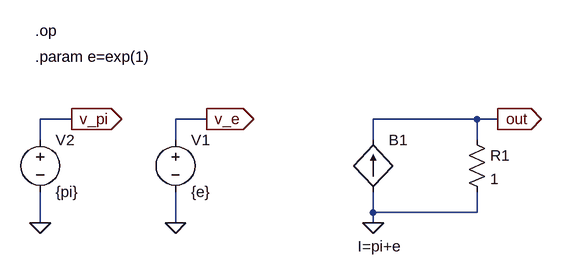
[diagram p0: schematic pi_e.asc]
pi_e.asc, the LTspice schematic file:
Version 4
SHEET 1 1572 680
WIRE -432 208 -432 176
WIRE -432 336 -432 288
WIRE -384 176 -432 176
WIRE -224 208 -224 176
WIRE -224 336 -224 288
WIRE -176 176 -224 176
WIRE 80 208 80 176
WIRE 80 320 80 288
WIRE 80 336 80 320
WIRE 240 176 80 176
WIRE 240 208 240 176
WIRE 240 320 80 320
WIRE 240 320 240 288
WIRE 272 176 240 176
FLAG -224 336 0
FLAG -176 176 v_e
IOPIN -176 176 Out
FLAG 80 336 0
FLAG 272 176 out
IOPIN 272 176 Out
FLAG -432 336 0
FLAG -384 176 v_pi
IOPIN -384 176 Out
SYMBOL bi2 80 208 R0
WINDOW 3 -24 164 Left 0
SYMATTR Value I=pi+e
SYMATTR InstName B1
SYMBOL res 224 192 R0
SYMATTR InstName R1
SYMATTR Value 1
SYMBOL voltage -224 192 R0
SYMATTR InstName V1
SYMATTR Value {e}
SYMBOL voltage -432 192 R0
SYMATTR InstName V2
SYMATTR Value {pi}
TEXT -440 40 Left 0 !.op
TEXT -440 80 Left 0 !.param e=exp(1)

The netlist it stands for:
* pi_e.asc
B1 0 out I=pi+e
R1 out 0 1
V1 v_e 0 {e}
V2 v_pi 0 {pi}
.op
.param e=exp(1)
.backanno
.end